# EAGLE design x-OSC Gloves (EAGLE 6.4)
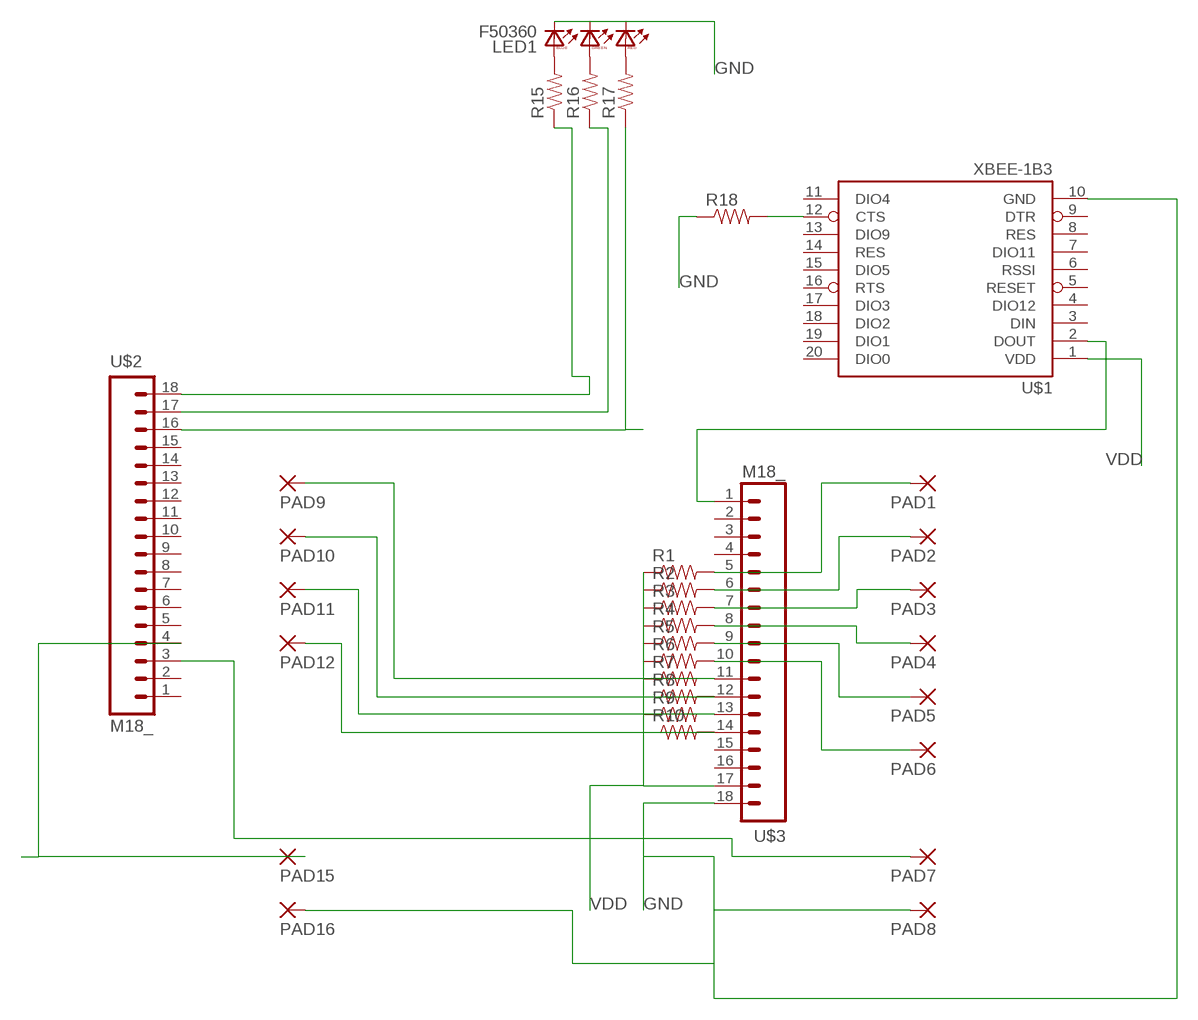
[diagram p0: schematic, sheet 1]

## Parts
LED1  F50360  [F50360]
PAD1  3,81/1,4  [3,81/1,4]
PAD2  3,81/1,4  [3,81/1,4]
PAD3  3,81/1,4  [3,81/1,4]
PAD4  3,81/1,4  [3,81/1,4]
PAD5  3,81/1,4  [3,81/1,4]
PAD6  3,81/1,4  [3,81/1,4]
PAD7  3,81/1,4  [3,81/1,4]
PAD8  3,81/1,4  [3,81/1,4]
PAD9  3,81/1,4  [3,81/1,4]
PAD10  3,81/1,4  [3,81/1,4]
PAD11  3,81/1,4  [3,81/1,4]
PAD12  3,81/1,4  [3,81/1,4]
PAD15  3,81/1,4  [3,81/1,4]
PAD16  3,81/1,4  [3,81/1,4]
R1  RESISTOR0805-RES  [0805]
R2  RESISTOR0805-RES  [0805]
R3  RESISTOR0805-RES  [0805]
R4  RESISTOR0805-RES  [0805]
R5  RESISTOR0805-RES  [0805]
R6  RESISTOR0805-RES  [0805]
R7  RESISTOR0805-RES  [0805]
R8  RESISTOR0805-RES  [0805]
R9  RESISTOR0805-RES  [0805]
R10  RESISTOR0805-RES  [0805]
R15  RESISTOR0805-RES  [0805]
R16  RESISTOR0805-RES  [0805]
R17  RESISTOR0805-RES  [0805]
R18  RESISTOR0805-RES  [0805]
U$1  XBEE-1B3  [XBEE-SMD]
U$2  M18_  [1X18]
U$3  M18_  [1X18]

## Nets
GND: LED1.BC LED1.GC LED1.RC PAD8.1(P) PAD16.1(P) R18.1 U$1.10(GND) U$3.18
N$1: LED1.BA R15.2
N$2: LED1.GA R16.2
N$3: PAD3.1(P) R3.2 U$3.7
N$4: PAD4.1(P) R4.2 U$3.8
N$5: PAD5.1(P) R5.2 U$3.9
N$6: PAD6.1(P) R6.2 U$3.10
N$7: PAD9.1(P) R7.2 U$3.11
N$8: PAD10.1(P) R8.2 U$3.12
N$9: PAD11.1(P) R9.2 U$3.13
N$12: R17.1 U$2.16
N$13: PAD2.1(P) R2.2 U$3.6
N$14: R18.2 U$1.12(CTS)
N$15: PAD7.1(P) U$2.3
N$16: PAD15.1(P) U$2.4
N$17: LED1.RA R17.2
N$18: R15.1 U$2.18
N$19: R16.1 U$2.17
N$20: PAD12.1(P) R10.2 U$3.14
N$21: PAD1.1(P) R1.2 U$3.5
N$22: U$1.2(DOUT) U$3.1
VDD: R1.1 R2.1 R3.1 R4.1 R5.1 R6.1 R7.1 R8.1 R9.1 R10.1 U$1.1(VDD) U$3.17
Unconnected: U$1.3(DIN) U$1.4(DIO12) U$1.5(RESET) U$1.6(RSSI) U$1.7(DIO11) U$1.8(RES) U$1.9(DTR) U$1.11(DIO4) U$1.13(DIO9) U$1.14(RES) U$1.15(DIO5) U$1.16(RTS) U$1.17(DIO3) U$1.18(DIO2) U$1.19(DIO1) U$1.20(DIO0) U$2.1 U$2.2 U$2.5 U$2.6 U$2.7 U$2.8 U$2.9 U$2.10 U$2.11 U$2.12 U$2.13 U$2.14 U$2.15 U$3.2 U$3.3 U$3.4 U$3.15 U$3.16

## Library data of the parts
LED1 = led:F50360: Full color Z-Power LED RGB P5-II Series Source: http://www.seoulsemicon.co.kr .. F50360.pdf
PAD1-PAD12 PAD15 PAD16 = wirepad:3,81/1,4: THROUGH-HOLE PAD
R1-R10 R15-R18 = SparkFun-Passives:RESISTOR: Resistor Basic schematic elements and footprints for 0603, 1206, and PTH resistors.
U$1 = SparkFun-RF:XBEE-1: Xbee module footprints SMT header is CONN-09042.; PROD_ID: CONN-09042
U$2 U$3 = SparkFun-Connectors:M18: 1x18 .1" header

## Board
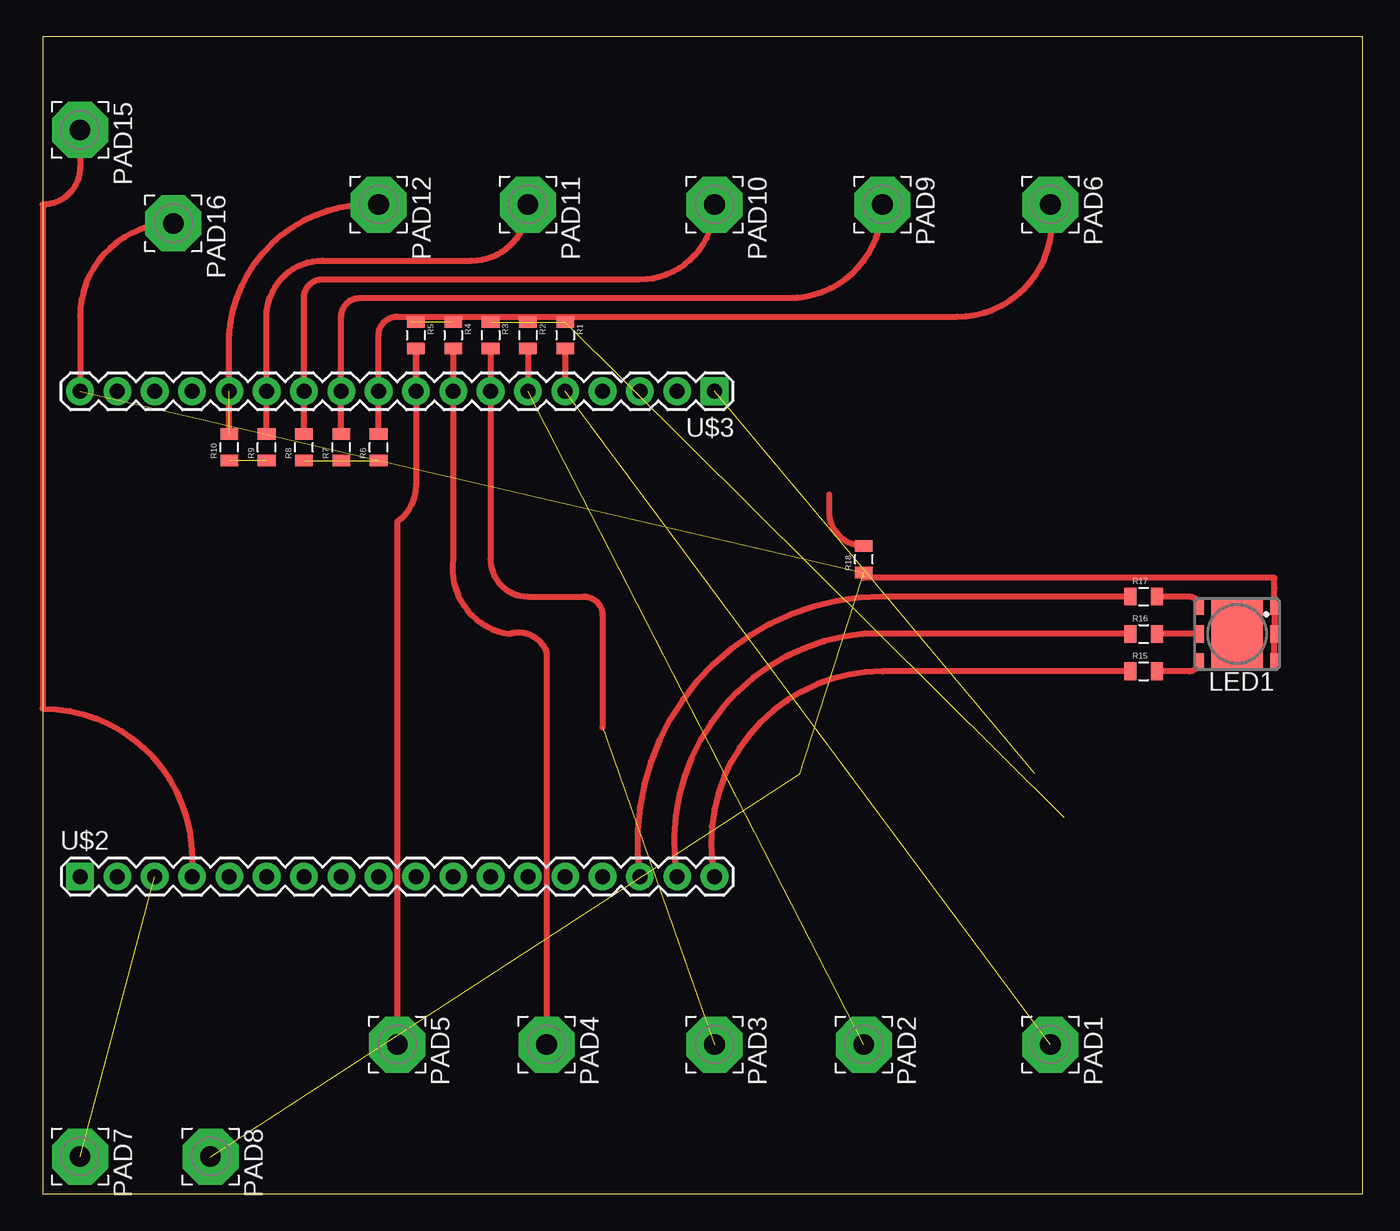
[diagram p1: board, top side]
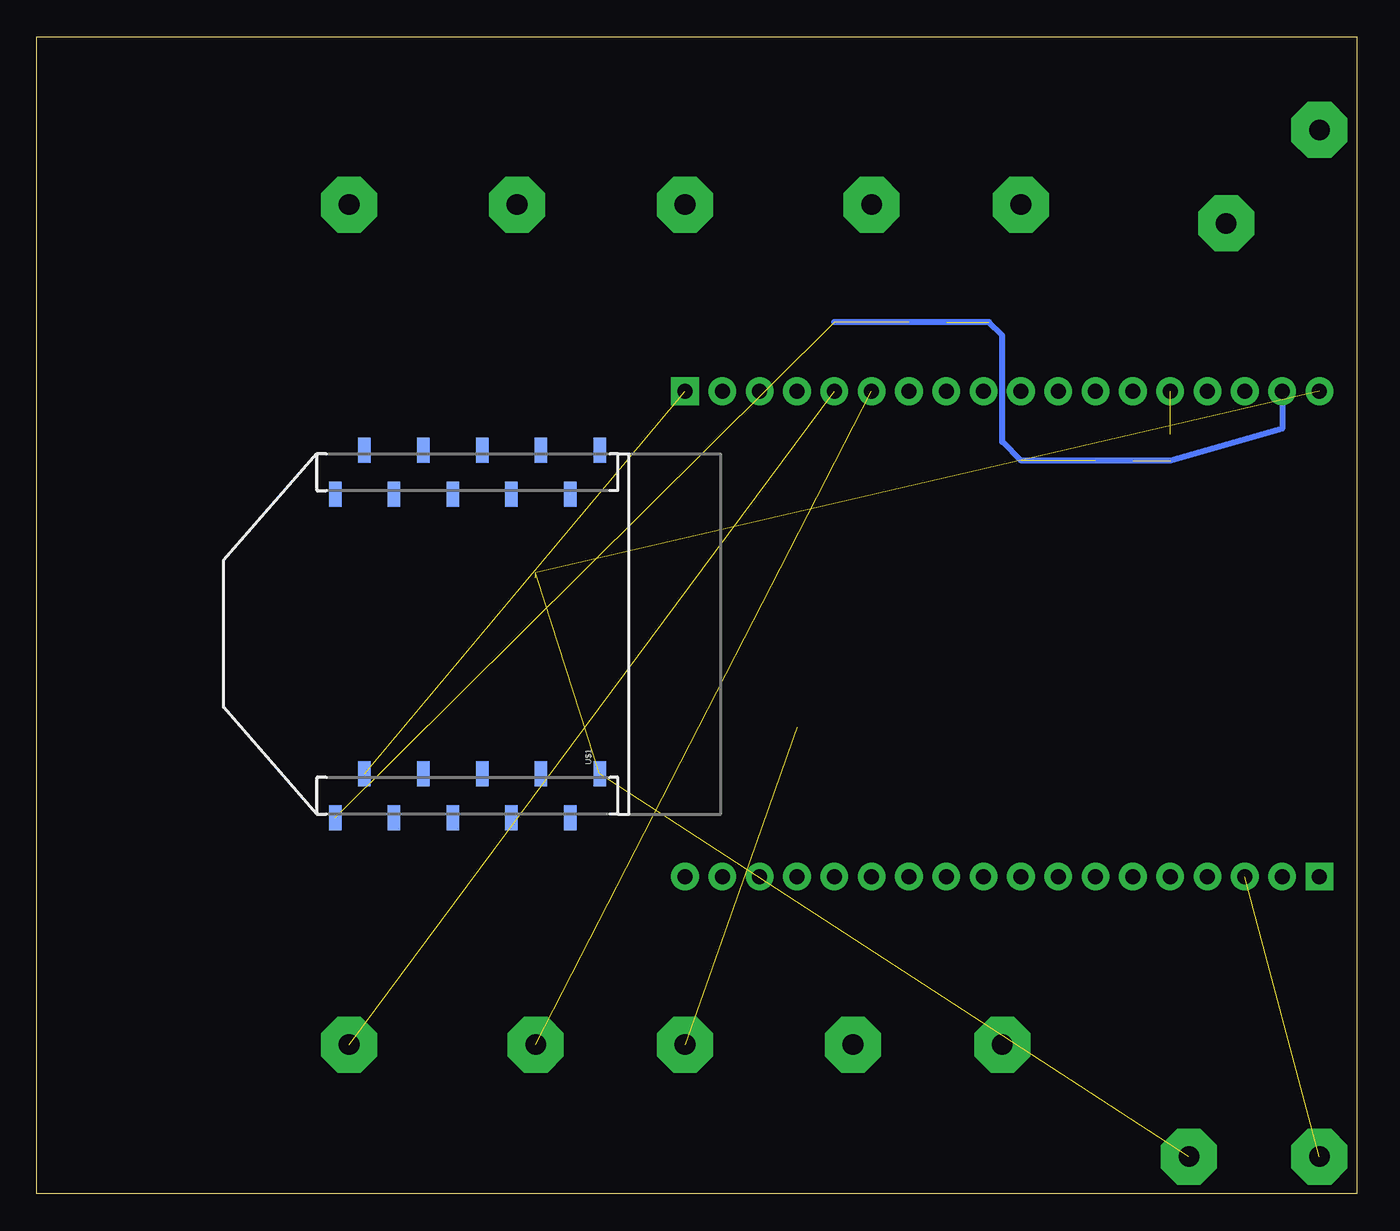
[diagram p2: board, bottom side, seen from below]

Size 89.84 x 78.73 mm. Coordinates in mm from the lower left corner, seen from the top.
Outline: 0,0 89.84,0 89.84,78.73 0,78.73 0,0
Copper layers (1*16): Top 0.035mm / dielectric 1.5mm / Bottom 0.035mm
Design rules "default": minimum track width 10mil, minimum drill 24mil, track to track 8mil, track to pad 8mil, pad to pad 8mil, via to via 8mil, smd to smd 8mil, copper to edge 40mil, drill to drill 8mil, minimum pad ring 10mil, minimum via ring 8mil, stop-mask expansion 4mil, vias tented up to drill 0mil, thermal gap 10mil

### Footprints (pad centres in the part's own frame; a part is rotated, then mirrored left to right if it is on the bottom)
F50360 = smd 0.6 x 1.05: BA 2.55,1.825; BC -2.55,1.825; RA 2.55,-1.825; RC -2.55,-1.825 | smd 0.6 x 1.2: GA 2.55,0; GC -2.55,0 | smd 3.5 x 4.7: NC 0,0
3,81/1,4 = drill 1.397 pad 3.81 octagon: 1 0,0
0805 = smd 0.8 x 1.2: 1 -0.9,0; 2 0.9,0
XBEE-SMD = smd 1.7 x 0.85: 1 -12.5,20; 2 -9.5,18; 3 -12.5,16; 4 -9.5,14; 5 -12.5,12; 6 -9.5,10; 7 -12.5,8; 8 -9.5,6; 9 -12.5,4; 10 -9.5,2; 11 12.5,2; 12 9.5,4; 13 12.5,6; 14 9.5,8; 15 12.5,10; 16 9.5,12; 17 12.5,14; 18 9.5,16; 19 12.5,18; 20 9.5,20
1X18 = drill 1.016 pad 1.88 square: 1 0,0 | drill 1.016 pad 1.88: 2 2.54,0; 3 5.08,0; 4 7.62,0; 5 10.16,0; 6 12.7,0; 7 15.24,0; 8 17.78,0; 9 20.32,0; 10 22.86,0; 11 25.4,0; 12 27.94,0; 13 30.48,0; 14 33.02,0; 15 35.56,0; 16 38.1,0; 17 40.64,0; 18 43.18,0

### Placement (x,y rotation side)
LED1  81.28,38.1 180 top
PAD1  68.58,10.16 270 top
PAD2  55.88,10.16 270 top
PAD3  45.72,10.16 270 top
PAD4  34.29,10.16 270 top
PAD5  24.13,10.16 270 top
PAD6  68.58,67.31 270 top
PAD7  2.54,2.54 270 top
PAD8  11.43,2.54 270 top
PAD9  57.15,67.31 270 top
PAD10  45.72,67.31 270 top
PAD11  33.02,67.31 270 top
PAD12  22.86,67.31 270 top
PAD15  2.54,72.39 270 top
PAD16  8.89,66.04 270 top
R1  35.56,58.42 270 top
R2  33.02,58.42 270 top
R3  30.48,58.42 270 top
R4  27.94,58.42 270 top
R5  25.4,58.42 270 top
R6  22.86,50.8 90 top
R7  20.32,50.8 90 top
R8  17.78,50.8 90 top
R9  15.24,50.8 90 top
R10  12.7,50.8 90 top
R15  74.93,35.56 0 top
R16  74.93,38.1 0 top
R17  74.93,40.64 0 top
R18  55.88,43.18 90 top
U$1  49.53,38.1 90 bottom
U$2  2.54,21.59 0 top
U$3  45.72,54.61 180 top

### Tracks (layer width: path | path; a pad name or v marks a point on that pad's centre or on a via)
GND  (4 unrouted)
  Top 0.406: PAD16.1 arc90 2.54,59.69 U$3.18 | LED1.BC LED1.GC LED1.RC arc0 83.82,41.91 55.88,41.91
N$1
  Top 0.406: LED1.BA arc-90 78.02,35.56 R15.2
N$2
  Top 0.406: LED1.GA R16.2
N$3  (1 unrouted)
  Top 0.406: R3.2 U$3.7 30.48,43.18 arc90 33.02,40.64 36.83,40.64 arc-90 38.1,39.37 38.1,31.75
N$4
  Top 0.406: R4.2 U$3.8 27.94,43.18 arc90 31.75,38.1 arc-90 34.29,36.83 PAD4.1
N$5
  Top 0.406: U$3.9 R5.2 25.4,48.26 arc-53 24.13,45.72 PAD5.1
N$6
  Top 0.406: R6.2 U$3.10 22.86,58.42 arc-90 24.13,59.69 62.23,59.69 arc100 PAD6.1
N$7
  Top 0.406: R7.2 U$3.11 20.32,59.69 arc-90 21.59,60.96 50.8,60.96 arc90 PAD9.1
N$8
  Top 0.406: R8.2 U$3.12 17.78,60.96 arc-90 19.05,62.23 40.64,62.23 arc90 PAD10.1
N$9
  Top 0.406: R9.2 U$3.13 15.24,59.69 arc-90 19.05,63.5 29.21,63.5 arc90 PAD11.1
N$12
  Top 0.406: R17.1 57.15,40.64 arc98 U$2.16
N$13  (1 unrouted)
  Top 0.406: R2.2 U$3.6
N$14  (1 unrouted)
  Top 0.406: R18.2 arc-90 53.53,46.43 U$1.12
N$15  (1 unrouted)
N$16
  Top 0.406: PAD15.1 2.54,69.85 arc-90 0,67.31 0,33.02 arc-90 10.16,22.86 U$2.4
N$17
  Top 0.406: LED1.RA arc90 78.02,40.64 R17.2
N$18
  Top 0.406: R15.1 57.15,35.56 arc101 U$2.18
N$19
  Top 0.406: R16.1 55.88,38.1 arc95 U$2.17
N$20  (1 unrouted)
  Top 0.406: R10.2 12.7,58.42 arc-90 PAD12.1
N$21  (1 unrouted)
  Top 0.406: R1.2 U$3.5
N$22  (1 unrouted)
VDD  (11 unrouted)
  Bottom 0.406: U$3.17 5.08,52.07 R10.1 R6.1 24.13,51.17 24.13,58.42 25.03,59.32 R1.1